# EAGLE design aardvark-v0.70 (EAGLE 9.6.2)
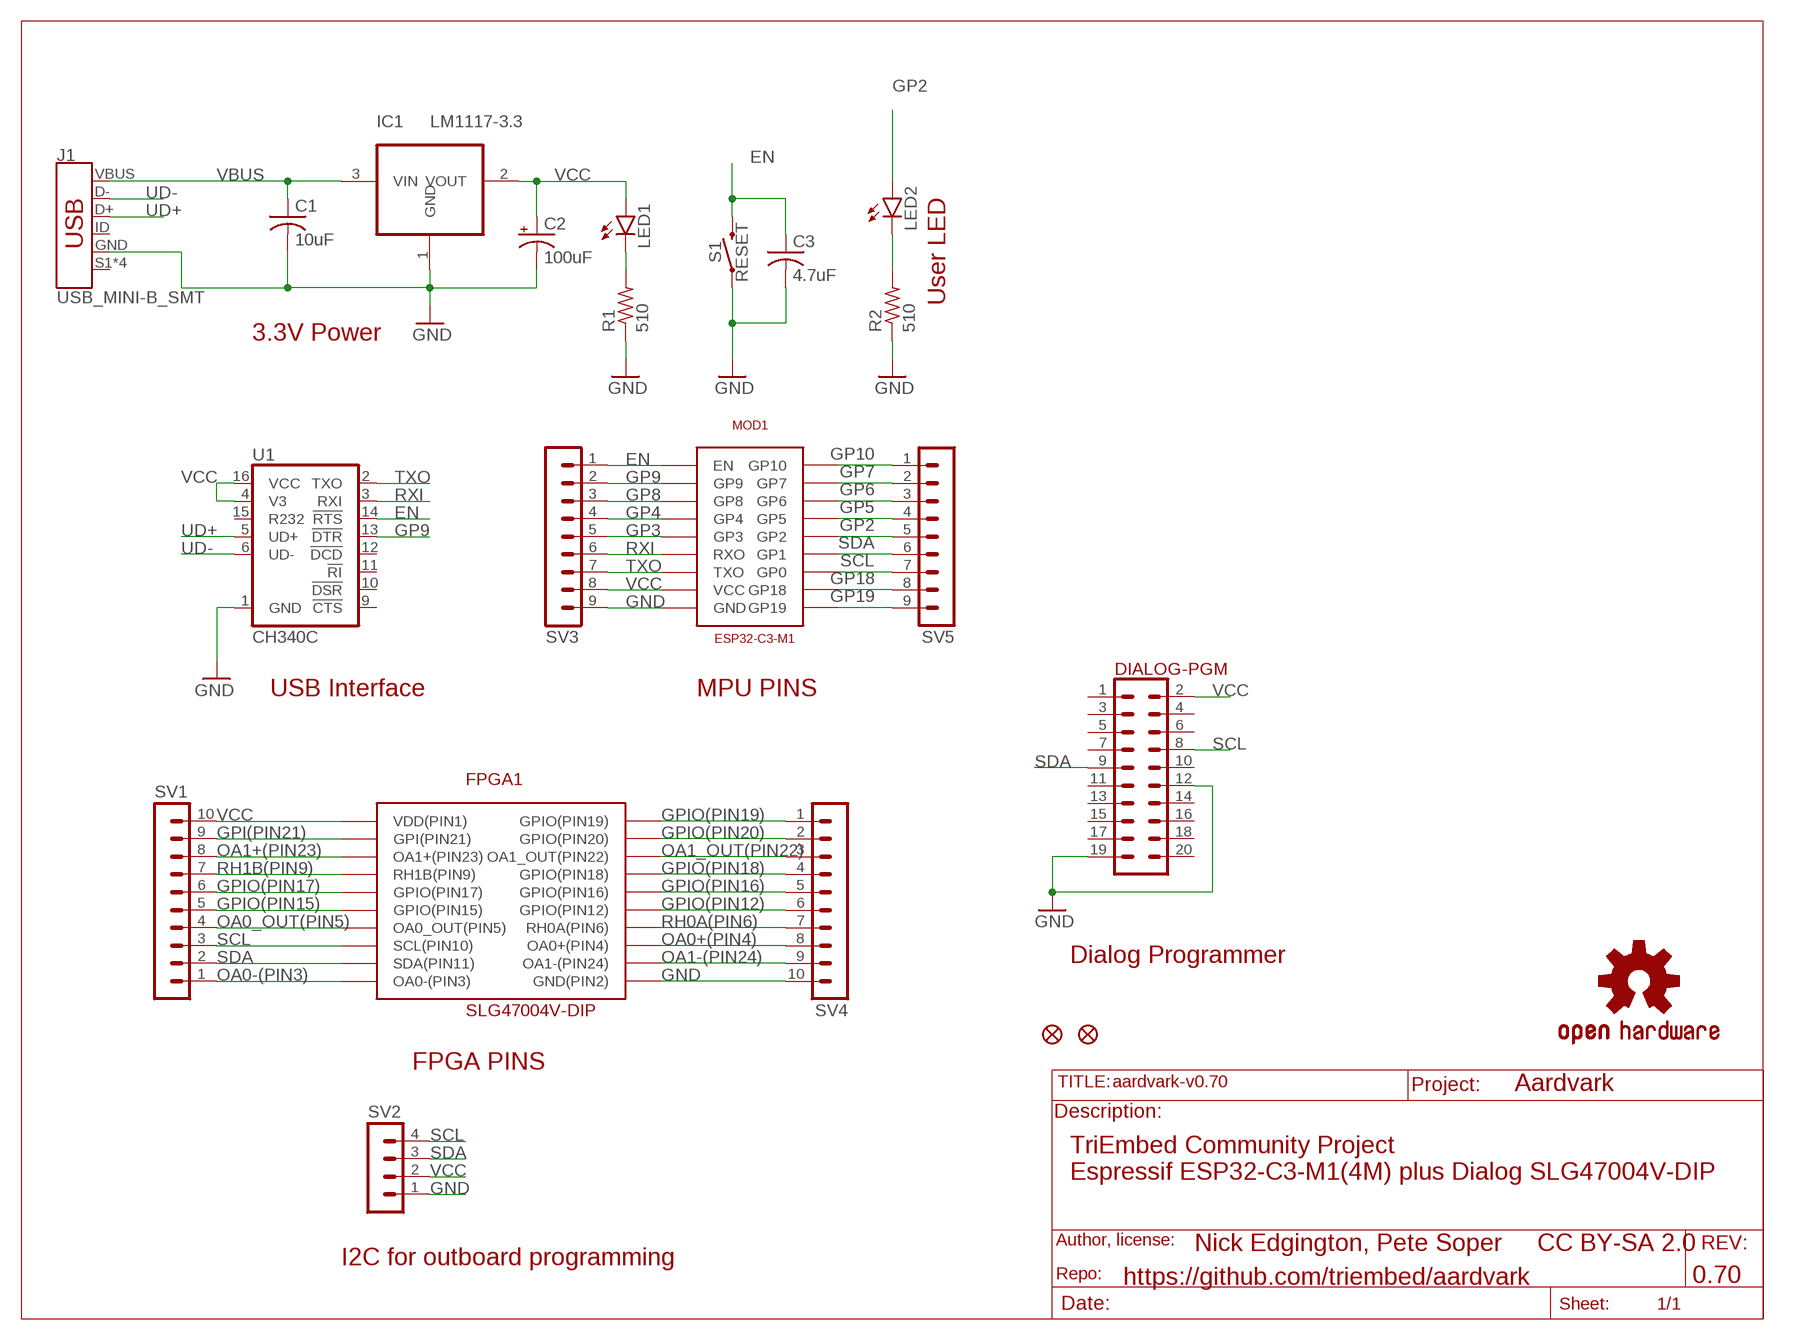
[diagram p0: schematic, sheet 1]

## Parts
C1  10uF  C-USC0805  [C0805]
C2  100uF  47UF-POLAR-PANASONIC_D-50V-20%  [PANASONIC_D]
C3  4.7uF  C-USC0805  [C0805]
DIALOG-PGM  CONN_10X2  [2X10]
FD1  FIDUCIAL1X2  [FIDUCIAL-1X2]
FD2  FIDUCIAL1X2  [FIDUCIAL-1X2]
FPGA1  SLG47004V-DIP  SLG47004V_DIP  [SLG47004V-DIP]
IC1  LM1117-3.3  REG1117  [SOT223]
J1  USB_MINI-B_SMT  [USB-MINIB]
LED1  LEDCHIP-LED0805  [CHIP-LED0805]
LED2  LEDCHIP-LED0805  [CHIP-LED0805]
LOGO1  OSHW-LOGOMINI  [OSHW-LOGO-MINI]
MOD1  ESP32-C3-M1  AITHINKER-C3-M1  [AITHINKER-C3-M1]
R1  510  R-US_R0805  [R0805]
R2  510  R-US_R0805  [R0805]
S1  RESET  MOMENTARY-SWITCH-SPST-SMD-6.0X3.5MM  [TACTILE_SWITCH_SMD_6.0X3.5MM]
SV1  MA10-1  [MA10-1]
SV2  MA04-1  [MA04-1]
SV3  MA09-1  [MA09-1]
SV4  MA10-1  [MA10-1]
SV5  MA09-1  [MA09-1]
U1  CH340C  [SO016]

## Nets
EN: C3.1 MOD1.PIN1(EN) S1.2 SV3.1 U1.14(!RTS)
GND [power]: C1.2 C2.- C3.2 DIALOG-PGM.12 DIALOG-PGM.19 FPGA1.11(GND(PIN2)) IC1.1(GND) J1.GND MOD1.PIN9(GND) R1.1 R2.1 S1.1 SV2.1 SV3.9 SV4.10 U1.1(GND)
GP2: LED2.A MOD1.PIN14(GP2) SV5.5
GP3: MOD1.PIN5(GP3) SV3.5
GP4: MOD1.PIN4(GP4) SV3.4
GP5: MOD1.PIN15(GP5) SV5.4
GP6: MOD1.PIN16(GP6) SV5.3
GP7: MOD1.PIN17(GP7) SV5.2
GP8: MOD1.PIN3(GP8) SV3.3
GP9: MOD1.PIN2(GP9) SV3.2 U1.13(!DTR)
GP10: MOD1.PIN18(GP10) SV5.1
GP18: MOD1.PIN11(GP18) SV5.8
GP19: MOD1.PIN10(GP19) SV5.9
GPI(PIN21): FPGA1.2(GPI(PIN21)) SV1.9
GPIO(PIN12): FPGA1.15(GPIO(PIN12)) SV4.6
GPIO(PIN15): FPGA1.6(GPIO(PIN15)) SV1.5
GPIO(PIN16): FPGA1.16(GPIO(PIN16)) SV4.5
GPIO(PIN17): FPGA1.5(GPIO(PIN17)) SV1.6
GPIO(PIN18): FPGA1.17(GPIO(PIN18)) SV4.4
GPIO(PIN19): FPGA1.20(GPIO(PIN19)) SV4.1
GPIO(PIN20): FPGA1.19(GPIO(PIN20)) SV4.2
N$1: LED2.C R2.2
N$3: LED1.C R1.2
OA0+(PIN4): FPGA1.13(OA0+(PIN4)) SV4.8
OA0-(PIN3): FPGA1.10(OA0-(PIN3)) SV1.1
OA0_OUT(PIN5): FPGA1.7(OA0_OUT(PIN5)) SV1.4
OA1+(PIN23): FPGA1.3(OA1+(PIN23)) SV1.8
OA1-(PIN24): FPGA1.12(OA1-(PIN24)) SV4.9
OA1_OUT(PIN22): FPGA1.18(OA1_OUT(PIN22)) SV4.3
RH0A(PIN6): FPGA1.14(RH0A(PIN6)) SV4.7
RH1B(PIN9): FPGA1.4(RH1B(PIN9)) SV1.7
RXI: MOD1.PIN6(RXO) SV3.6 U1.3(RXI)
SCL: DIALOG-PGM.8 FPGA1.8(SCL(PIN10)) MOD1.PIN12(GP0) SV1.3 SV2.4 SV5.7
SDA: DIALOG-PGM.9 FPGA1.9(SDA(PIN11)) MOD1.PIN13(GP1) SV1.2 SV2.3 SV5.6
TXO: MOD1.PIN7(TXO) SV3.7 U1.2(TXO)
UD+: J1.D+ U1.5(UD+)
UD-: J1.D- U1.6(UD-)
VBUS [power]: C1.1 IC1.3(VIN) J1.VBUS
VCC [power]: C2.+ DIALOG-PGM.2 FPGA1.1(VDD(PIN1)) IC1.2(VOUT) LED1.A MOD1.PIN8(VCC) SV1.10 SV2.2 SV3.8 U1.4(V3) U1.16(VCC)
Unconnected: DIALOG-PGM.1 DIALOG-PGM.3 DIALOG-PGM.4 DIALOG-PGM.5 DIALOG-PGM.6 DIALOG-PGM.7 DIALOG-PGM.10 DIALOG-PGM.11 DIALOG-PGM.13 DIALOG-PGM.14 DIALOG-PGM.15 DIALOG-PGM.16 DIALOG-PGM.17 DIALOG-PGM.18 DIALOG-PGM.20 J1.ID J1.S1(SHIELD) J1.S2(SHIELD) J1.S3(SHIELD) J1.S4(SHIELD) U1.9(!CTS) U1.10(!DSR) U1.11(!RI) U1.12(!DCD) U1.15(R232)

## Notes on the sheet
- User LED
- 3.3V Power
- USB Interface | MPU PINS
- Dialog Programmer
- FPGA PINS
- Aardvark
- TriEmbed Community Project
  Espressif ESP32-C3-M1(4M) plus Dialog SLG47004V-DIP
- Nick Edgington, Pete Soper     CC BY-SA 2.0
- I2C for outboard programming
- https://github.com/triembed/aardvark | 0.70

## Library data of the parts
C1 C3 = rcl:C-US: CAPACITOR, American symbol; SPICEPREFIX: C
C2 = SparkFun-Capacitors:47UF-POLAR: 47µF polarized capacitors A capacitor is a passive two-terminal electrical component used to store electrical energy temporarily in an electric field.
DIALOG-PGM = SparkFun-Connectors:CONN_10X2: Multi connection point. Often used as Generic Header-pin footprint for 0.1 inch spaced/style header connections On any of the 0.1 inch spaced packages, you can populate with these: Break Away Headers - Straight <https://www.sparkfun.com/products/116> (PRT-00116) Break Away Male Headers - Right Angle <https://www.sparkfun.com/products/553> (PRT-00553) Female Headers <https://www.sparkfun.com/products/115> (PRT-00115) Break Away Headers - Machine Pin <https://www.sparkfun.com/products/117> (PRT-00117) Break Away Female Headers - Swiss Machine Pin <https://www.sparkfun.com/products/743> (PRT-00743) Special note about the "SPECIAL" package: This was SPECIALLY designed to be used with our Graphic LCD Backpack. Be sure you want to use this! It is not only staggered on each line of header holes, but IT IS ALSO offset of the center point of the top and bottom lines by 5 mil. This causes the headers to lock into place on the "standard" footprint on the LCD screen. The extra squares on the tdocu layer are there simply to reference other pins (if you were to actually populate a longer header than ten long - this is what we do with the backpacks).
FD1 FD2 = apexprotofactory:FIDUCIAL: Fiducial Alignment Points Derived from SparkFun library but with cream (paste) included in pad. This is necessary for stencil creation by OSH Stencils!!
FPGA1 = SLG47004V-DIP:SLG47004V_DIP
IC1 = burr-brown:REG1117: 800mA and 1A Low Dropout (LDO) Positive Regulator 1.8V, 2.5V, 2.85V, 3.3V, 5V, and Adj; MPN: REG1117; OC_FARNELL: 1097566; OC_NEWARK: 14P6981
J1 = SparkFun-Connectors:USB_MINI-B: USB type Mini-B Connector Breaks out 5th pin, and includes shield pins if needed. SparkFun Products: SparkFun FTDI Basic Breakout <https://www.sparkfun.com/products/9716> SparkFun XBee Explorer USB <https://www.sparkfun.com/products/11812> SparkFun Redboard <https://www.sparkfun.com/products/12757>; PROD_ID: CONN-08193; SF_ID: PRT-00587
LED1 LED2 = led:LED: LED OSRAM: - CHIPLED LG R971, LG N971, LY N971, LG Q971, LY Q971, LO R971, LY R971 LH N974, LH R974 LS Q976, LO Q976, LY Q976 LO Q996 - Hyper CHIPLED LW Q18S LB Q993, LB Q99A, LB R99A - SideLED LS A670, LO A670, LY A670, LG A670, LP A670 LB A673, LV A673, LT A673, LW A673 LH A674 LY A675 LS A676, LA A676, LO A676, LY A676, LW A676 LS A679, LY A679, LG A679 - Hyper Micro SIDELED® LS Y876, LA Y876, LO Y876, LY Y876 LT Y87S - SmartLED LW L88C, LW L88S LB L89C, LB L89S, LG L890 LS L89K, LO L89K, LY L89K LS L896, LA L896, LO L896, LY L896 - TOPLED LS T670, LO T670, LY T670, LG T670, LP T670 LSG T670, LSP T670, LSY T670, LOP T670, LYG T670 LG T671, LOG T671, LSG T671 LB T673, LV T673, LT T673, LW T673 LH T674 LS T676, LA T676, LO T676, LY T676, LB T676, LH T676, LSB T676, LW T676 LB T67C, LV T67C, LT T67C, LS T67K, LO T67K, LY T67K, LW E67C LS E67B, LA E67B, LO E67B, LY E67B, LB E67C, LV E67C, LT E67C LW T67C LS T679, LY T679, LG T679 LS T770, LO T770, LY T770, LG T770, LP T770 LB T773, LV T773, LT T773, LW T773 LH T774 LS E675, LA E675, LY E675, LS T675 LS T776, LA T776, LO T776, LY T776, LB T776 LHGB T686 LT T68C, LB T68C - Hyper Mini TOPLED® LB M676 - Mini TOPLED Santana® LG M470 LS M47K, LO M47K, LY M47K Source: http://www.osram.convergy.de LUXEON: - LUMILED® LXK2-PW12-R00, LXK2-PW12-S00, LXK2-PW14-U00, LXK2-PW14-V00 LXK2-PM12-R00, LXK2-PM12-S00, LXK2-PM14-U00 LXK2-PE12-Q00, LXK2-PE12-R00, LXK2-PE12-S00, LXK2-PE14-T00, LXK2-PE14-U00 LXK2-PB12-K00, LXK2-PB12-L00, LXK2-PB12-M00, LXK2-PB14-N00, LXK2-PB14-P00, LXK2-PB14-Q00 LXK2-PR12-L00, LXK2-PR12-M00, LXK2-PR14-Q00, LXK2-PR14-R00 LXK2-PD12-Q00, LXK2-PD12-R00, LXK2-PD12-S00 LXK2-PH12-R00, LXK2-PH12-S00 LXK2-PL12-P00, LXK2-PL12-Q00, LXK2-PL12-R00 Source: www.luxeon.com KINGBRIGHT: KA-3528ASYC Source: www.kingbright.com
LOGO1 = SparkFun-Aesthetics:OSHW-LOGO: Open-Source Hardware (OSHW) Logo This logo indicates the piece of hardware it is found on incorporates a OSHW license and/or adheres to the definition of open source hardware found here: http://freedomdefined.org/OSHW
MOD1 = aithinker-C3-M1:AITHINKER-C3-M1: ESPRESSIF ESP32 C3 M1 module from AI Thinker
R1 R2 = rcl:R-US_: RESISTOR, American symbol; SPICEPREFIX: R
S1 = SparkFun-Switches:MOMENTARY-SWITCH-SPST: Momentary Switch (Pushbutton) - SPST Normally-open (NO) SPST momentary switches (buttons, pushbuttons). Variants PTH-12MM - 12mm square, through-hole Momentary Pushbutton Switch - 12mm Square <https://www.sparkfun.com/products/9190> (COM-09190) PTH-6.0MM, PTH-6.0MM-KIT - 6.0mm square, through-hole Mini Pushbutton Switch <https://www.sparkfun.com/products/97> (COM-00097) KIT package intended for soldering kit's - only one side of pads' copper is exposed. PTH-RIGHT-ANGLE-KIT - Right-angle, through-hole Right Angle Tactile Button <https://www.sparkfun.com/products/10791> - Used on SparkFun BigTime Watch Kit <https://www.sparkfun.com/products/11734> SMD-12MM - 12mm square, surface-mount Tactile Button - SMD (12mm) <https://www.sparkfun.com/products/12993> (COM-12993) Used on SparkFun PicoBoard <https://www.sparkfun.com/products/11888> SMD-4.5MM - 4.5mm Square Trackball Switch Used on SparkFun Blackberry Trackballer Breakout <https://www.sparkfun.com/products/13169> SMD-4.6MMX2.8MM - 4.60mm x 2.80mm, surface mount Used on SparkFun SAMD21 Mini Breakout <https://www.sparkfun.com/products/13664> SMD-5.2MM, SMD-5.2-REDUNDANT - 5.2mm square, surface-mount Mini Pushbutton Switch - SMD <https://www.sparkfun.com/products/8720> (COM-08720) Used on Arduino Pro Mini <https://www.sparkfun.com/products/11114> REDUNDANT package connects both switch circuits together SMD-6.0X3.5MM - 6.0 x 3.5mm, surface mount Momentary Reset Switch SMD <https://www.sparkfun.com/products/8229> (COM-08229) SMD-6.2MM-TALL - 6.2mm square, surface mount Tactile Button - SMD (6mm) <https://www.sparkfun.com/products/12992> Used on SparkFun Digital Sandbox <https://www.sparkfun.com/products/12651> SMD-RIGHT-ANGLE - Right-angle, surface mount Used on SparkFun Block for Intel® Edison - Arduino <https://www.sparkfun.com/products/13036>; PROD_ID: SWCH-14278; SF_SKU: COM-08229
SV1 SV4 = con-lstb:MA10-1: PIN HEADER; OC_FARNELL: unknown; OC_NEWARK: unknown
SV2 = con-lstb:MA04-1: PIN HEADER; OC_FARNELL: unknown; OC_NEWARK: unknown
SV3 SV5 = con-lstb:MA09-1: PIN HEADER; OC_FARNELL: unknown; OC_NEWARK: unknown
U1 = SparkFun-IC-Comms:CH340C; PROD_ID: IC-14038

## Net classes
1 power: width 0.381 mm

## Board
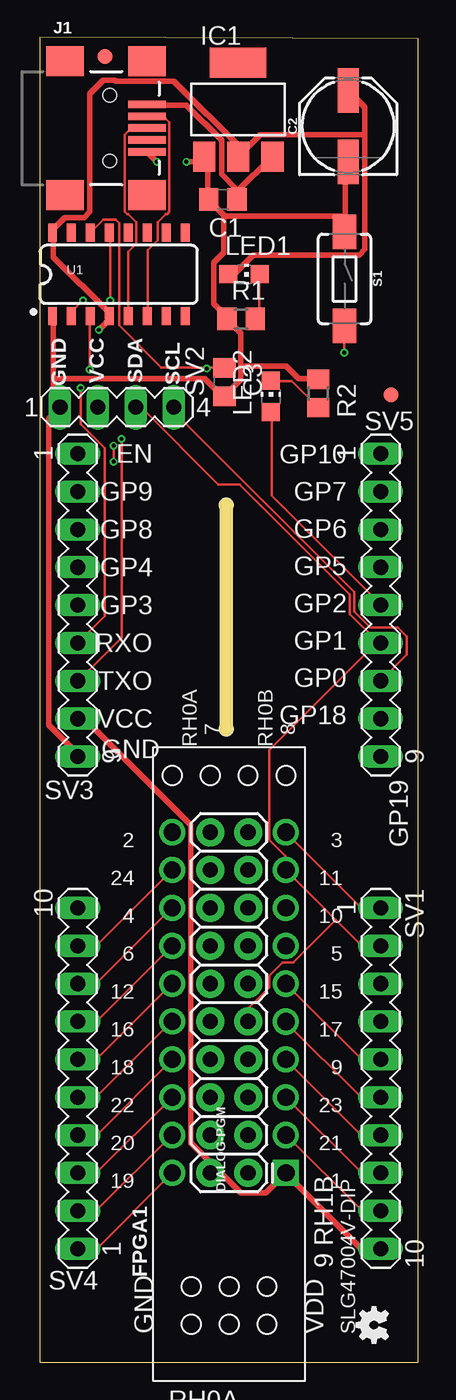
[diagram p1: board, top side]
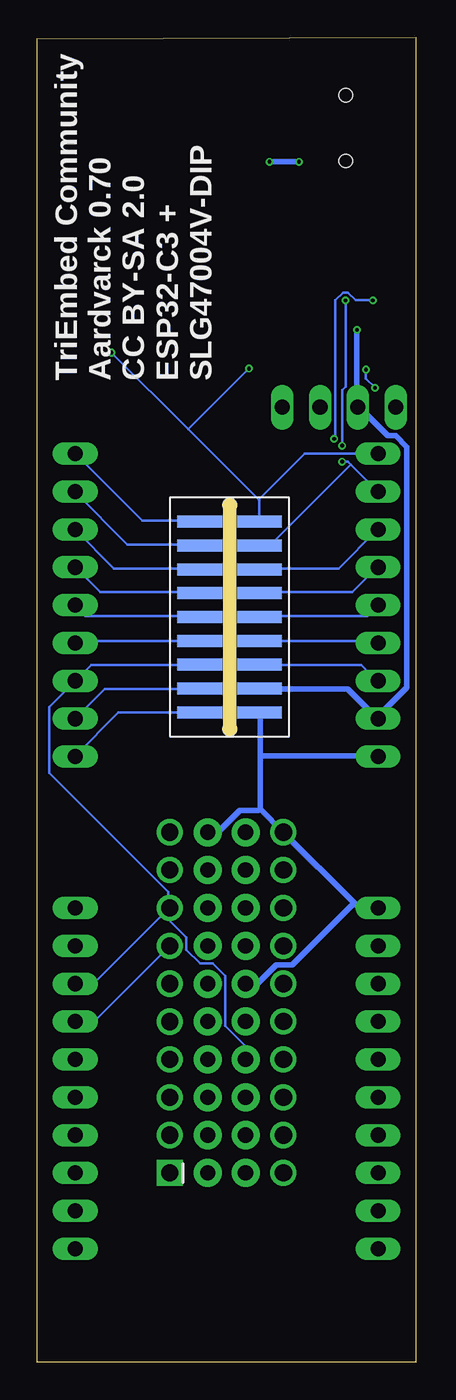
[diagram p2: board, bottom side, seen from below]

Size 25.4 x 88.9 mm. Coordinates in mm from the lower left corner, seen from the top.
Outline: 0,0 25.4,0 25.4,88.8 0,88.9 0,0
Copper layers (1*16): Top 0.035559375mm / dielectric 1.6mm / Bottom 0.035559375mm
Design rules "oshpark-2layer": minimum track width 6mil, minimum drill 10mil, track to track 6mil, track to pad 6mil, pad to pad 6mil, via to via 6mil, smd to smd 6mil, copper to edge 15mil, drill to drill 6mil, minimum pad ring 5mil, minimum via ring 5mil, stop-mask expansion 2.5mil, vias tented up to drill 0mil, thermal gap 10mil

### Footprints (pad centres in the part's own frame; a part is rotated, then mirrored left to right if it is on the bottom)
C0805 = smd 1.3 x 1.5: 1 -0.95,0; 2 0.95,0
PANASONIC_D = smd 3 x 1.4: + 2.4,0; - -2.4,0
2X10 = drill 1.016 pad 1.88: 1 0,0; 2 0,2.54; 3 2.54,0; 4 2.54,2.54; 5 5.08,0; 6 5.08,2.54; 7 7.62,0; 8 7.62,2.54; 9 10.16,0; 10 10.16,2.54; 11 12.7,0; 12 12.7,2.54; 13 15.24,0; 14 15.24,2.54; 15 17.78,0; 16 17.78,2.54; 17 20.32,0; 18 20.32,2.54; 19 22.86,0; 20 22.86,2.54
FIDUCIAL-1X2 = smd 1 x 1: 1 0,0
SLG47004V-DIP = drill 1.15 pad 1.75 square: 1 -5.08,-3.81 | drill 1.15 pad 1.75: 2 -2.54,-3.81; 3 0,-3.81; 4 2.54,-3.81; 5 5.074,-3.81; 6 7.62,-3.81; 7 10.16,-3.81; 8 12.7,-3.81; 9 15.24,-3.81; 10 17.78,-3.81; 11 17.78,3.81; 12 15.24,3.81; 13 12.7,3.81; 14 10.16,3.81; 15 7.62,3.81; 16 5.08,3.81; 17 2.54,3.81; 18 0,3.81; 19 -2.54,3.81; 20 -5.08,3.81
SOT223 = smd 1.499 x 2.007: 1 -2.261,-3.15; 2 0.025,-3.15; 3 2.311,-3.15 | smd 3.81 x 2.007: 4 0,3.15
USB-MINIB = smd 2.5 x 0.5: D+ 2.5,0; D- 2.5,0.8; GND 2.5,-1.6; ID 2.5,-0.8; VBUS 2.5,1.6 | smd 2.5 x 2: S1 -3,4.5; S2 2.5,4.5; S3 -3,-4.5; S4 2.5,-4.5 | hole 0.9: 0,2.2; 0,-2.2
CHIP-LED0805 = smd 1.2 x 1.2: A 0,-1.05; C 0,1.05
AITHINKER-C3-M1 = smd 0.8 x 3 bottom: PIN1 -6.4,-2; PIN2 -4.8,-2; PIN3 -3.2,-2; PIN4 -1.6,-2; PIN5 0,-2; PIN6 1.6,-2; PIN7 3.2,-2; PIN8 4.8,-2; PIN9 6.4,-2; PIN10 6.4,2; PIN11 4.8,2; PIN12 3.2,2; PIN13 1.6,2; PIN14 0,2; PIN15 -1.6,2; PIN16 -3.2,2; PIN17 -4.8,2; PIN18 -6.4,2 | hole 0.9: -7.5,0; 7.5,0
R0805 = smd 1.3 x 1.5: 1 -0.95,0; 2 0.95,0
TACTILE_SWITCH_SMD_6.0X3.5MM = smd 2.3 x 1.6: 1 -3.15,0; 2 3.15,0
MA10-1 = drill 1.016 long: 1 -11.43,0; 2 -8.89,0; 3 -6.35,0; 4 -3.81,0; 5 -1.27,0; 6 1.27,0; 7 3.81,0; 8 6.35,0; 9 8.89,0; 10 11.43,0
MA04-1 = drill 1.016 long: 1 -3.81,0; 2 -1.27,0; 3 1.27,0; 4 3.81,0
MA09-1 = drill 1.016 long: 1 -10.16,0; 2 -7.62,0; 3 -5.08,0; 4 -2.54,0; 5 0,0; 6 2.54,0; 7 5.08,0; 8 7.62,0; 9 10.16,0
SO016 = smd 0.6 x 1.2: 1 -4.445,-2.8; 2 -3.175,-2.8; 3 -1.905,-2.8; 4 -0.635,-2.8; 5 0.635,-2.8; 6 1.905,-2.8; 7 3.175,-2.8; 8 4.445,-2.8; 9 4.445,2.8; 10 3.175,2.8; 11 1.905,2.8; 12 0.635,2.8; 13 -0.635,2.8; 14 -1.905,2.8; 15 -3.175,2.8; 16 -4.445,2.8

### Placement (x,y rotation side)
C1  12.29,78.02 180 top
C2  20.69,82.93 90 top
C3  12.38,65.76 270 top
DIALOG-PGM  13.97,12.7 90 top
FD1  4.38,87.6 0 top
FD2  23.56,64.9 0 top
FPGA1  12.7,17.78 90 top
IC1  13.29,84.05 0 top
J1  4.7,82.8 0 top
LED1  13.7,73 270 top
LED2  15.5,64.8 0 top
LOGO1  22.4,2.5 90 top
MOD1  12.5,50 270 top
R1  13.5,70 0 top
R2  18.68,65 270 top
S1  20.44,72.68 270 top
SV1  22.86,19.05 270 top
SV2  5.17,64.07 0 top
SV3  2.54,50.8 270 top
SV4  2.54,19.05 90 top
SV5  22.86,50.8 270 top
U1  5.3,73 0 top

### Tracks (layer width: path | path; a pad name or v marks a point on that pad's centre or on a via)
EN  (via drill 0.25)
  Top 0.152: 11.2,66.75 12.34,66.75 C3.1 | 11.2,66.75 8.15,66.75 5.33,69.57 5.33,76.43 5.11,76.66 4.27,76.66 3.43,75.82 U1.14 | v20.42,67.74 20.42,69.49 S1.2 | v11.2,66.67 11.2,66.75
  Bottom 0.152: 10.55,57.87 10.52,57.84 10.52,56.46 MOD1.PIN1 | 10.55,57.87 15.28,62.6 | 15.28,62.6 v20.42,67.74 | SV3.1 7.47,60.96 10.55,57.87 | 15.28,62.6 v11.2,66.67
GND  (via drill 0.25)
  Top 0.381: C2.- 20.65,80.47 20.5,80.31 20.5,75.89 S1.1 20.34,76.89 12.42,76.89 | v7.85,80.54 7.24,81.15 J1.GND | v9.83,80.54 10.67,80.54 10.9,80.77 IC1.1 11.05,80.85 11.28,80.62 11.28,78.03 C1.2 11.43,77.88 12.42,76.89 | 0.91,65.99 0.91,64.47 1.29,64.08 SV2.1 1.22,63.93 0.61,63.32 0.61,42.75 2.52,40.84 2.52,40.69 SV3.9 | 0.91,65.99 0.91,70.18 U1.1 | 13.49,66.83 13.49,69.04 12.57,69.95 R1.1 12.5,70.18 11.66,71.02 11.66,73.76 12.34,74.45 12.34,76.73 12.42,76.89 | 13.49,66.83 13.49,65.91 12.42,64.85 C3.2 12.19,64.85 11.05,65.99 0.91,65.99 | 13.49,66.83 16.54,66.83 17.37,65.99 18.67,65.99 R2.1
  Bottom 0.381: 10.44,37.11 10.44,40.69 | 10.44,40.69 10.44,43.59 MOD1.PIN9 | 10.44,37.11 FPGA1.11 4.15,30.82 | SV4.10 3.81,30.48 4.15,30.82 | 10.44,40.69 2.59,40.69 SV3.9 | 4.15,30.82 8.31,26.67 9.37,26.67 10.59,25.45 11.43,25.45 DIALOG-PGM.12 | DIALOG-PGM.19 13.95,35.59 13.26,35.59 11.81,37.03 10.59,37.03 10.44,37.11 | v9.83,80.54 v7.85,80.54
GP2
  Top 0.152: LED2.A 15.54,63.7 15.54,58.14 22.86,50.83 SV5.5
  Bottom 0.152: MOD1.PIN14 14.55,50.06 22.17,50.06 22.86,50.75 SV5.5
GP3
  Bottom 0.152: SV3.5 3.28,50.06 10.44,50.06 MOD1.PIN5
GP4
  Bottom 0.152: MOD1.PIN4 10.44,51.66 4.27,51.66 2.59,53.34 SV3.4
GP5
  Bottom 0.152: SV5.4 21.18,51.66 14.55,51.66 MOD1.PIN15
GP6
  Bottom 0.152: MOD1.PIN16 14.55,53.26 20.27,53.26 22.86,55.85 SV5.3
GP7
  Bottom 0.152: MOD1.PIN17 14.55,54.86 19.36,54.86 22.86,58.37 SV5.2
GP8
  Bottom 0.152: MOD1.PIN3 10.44,53.26 5.18,53.26 2.59,55.85 SV3.3
GP9  (via drill 0.25)
  Top 0.152: v4.72,71.25 4.72,75.74 U1.13 | v4.95,60.43 v4.95,61.49
  Bottom 0.152: v4.72,71.25 4.72,65.46 4.95,65.23 v4.95,61.49 | v4.95,60.43 4.57,60.43 4.38,60.24 | 4.38,60.24 2.59,58.45 SV3.2 | 4.38,60.24 9.75,54.86 10.44,54.86 MOD1.PIN2
GP10
  Bottom 0.152: SV5.1 18.36,56.46 14.55,56.46 MOD1.PIN18
GP18
  Bottom 0.152: MOD1.PIN11 14.55,45.19 20.88,45.19 22.86,43.2 SV5.8
GP19
  Bottom 0.152: MOD1.PIN10 14.55,43.59 19.96,43.59 22.86,40.69 SV5.9
GPI(PIN21)
  Top 0.152: SV1.9 22.86,10.21 21.57,10.21 16.54,15.24 FPGA1.2
GPIO(PIN12)
  Top 0.152: SV4.6 2.59,20.34 3.81,20.34 8.84,25.38 FPGA1.15
GPIO(PIN15)
  Top 0.152: FPGA1.6 21.57,20.34 22.86,20.34 SV1.5
GPIO(PIN16)
  Top 0.152: SV4.5 2.59,17.83 3.81,17.83 8.84,22.86 FPGA1.16
GPIO(PIN17)
  Top 0.152: SV1.6 22.86,17.83 21.49,17.83 16.54,22.78 FPGA1.5
GPIO(PIN18)
  Top 0.152: SV4.4 3.81,15.24 FPGA1.17
GPIO(PIN19)
  Top 0.152: SV4.1 3.81,7.62 FPGA1.20
GPIO(PIN20)
  Top 0.152: SV4.2 2.59,10.21 3.81,10.21 8.84,15.24 FPGA1.19
N$1
  Top 0.152: LED2.C 15.54,65.84 16.92,65.84 18.67,64.08 R2.2
N$3
  Top 0.152: LED1.C 14.71,73 14.71,70.26 14.48,70.03 R1.2
OA0+(PIN4)
  Top 0.152: SV4.8 2.59,25.45 3.81,25.45 8.84,30.48 FPGA1.13
OA0-(PIN3)
  Top 0.152: SV1.1 21.57,30.48 16.54,35.51 FPGA1.10
OA0_OUT(PIN5)
  Bottom 0.152: SV1.4 21.57,22.86 16.54,27.89 FPGA1.7
OA1+(PIN23)
  Top 0.152: FPGA1.3 21.57,12.72 22.86,12.72 SV1.8
OA1-(PIN24)
  Top 0.152: SV4.9 2.59,27.96 3.81,27.96 8.84,32.99 FPGA1.12
OA1_OUT(PIN22)
  Top 0.152: SV4.3 2.59,12.72 3.81,12.72 8.84,17.75 FPGA1.18
RH0A(PIN6)
  Top 0.152: SV4.7 3.81,22.86 FPGA1.14
RH1B(PIN9)
  Top 0.152: SV1.7 21.57,15.24 16.54,20.27 FPGA1.4
RXI  (via drill 0.25)
  Top 0.152: v3.35,66.6 3.35,70.18 U1.3 | v2.74,65.38 2.74,62.94 4.34,61.34 4.34,50.06 SV3.6
  Bottom 0.152: v3.35,66.6 3.35,65.99 v2.74,65.38 | SV3.6 2.67,48.39 10.44,48.39 MOD1.PIN6
SCL
  Top 0.152: SV5.7 24.61,47.47 24.61,48.69 24,49.3 22.17,49.3 21.11,50.37 21.11,51.66 8.99,63.78 8.99,64.01 SV2.4
  Bottom 0.152: SV1.3 22.86,25.45 21.57,25.45 16.54,30.48 FPGA1.8 | DIALOG-PGM.8 11.43,21.18 12.8,22.55 12.8,25.91 13.64,26.75 14.48,26.75 15.39,27.66 15.39,28.5 16.92,30.02 FPGA1.8 | MOD1.PIN12 14.55,46.79 21.79,46.79 SV5.7 24.61,43.97 24.61,39.55 16.61,31.55 16.61,30.48 FPGA1.8
SDA
  Top 0.152: 19.85,29.68 FPGA1.9 16.46,33.07 16.46,33.98 15.39,35.05 15.39,41.07 22.63,48.31 SV5.6 22.86,48.31 22.71,48.31 20.8,50.22 20.8,51.51 13.41,58.9 11.96,58.9 6.86,64.01 6.48,64.01 SV2.3 | 19.85,29.68 21.57,27.96 22.86,27.96 SV1.2 | 19.85,29.68 16.99,26.82 16.31,26.82 15.39,25.91 15.39,25.15 14.02,23.77 14.02,22.86 DIALOG-PGM.9
  Bottom 0.152: MOD1.PIN13 14.55,48.39 22.78,48.39 22.86,48.31 SV5.6
TXO  (via drill 0.25)
  Top 0.152: v2.9,71.25 2.13,70.48 2.13,70.26 U1.2 | v5.49,61.95 5.49,48.62 2.59,45.72 SV3.7
  Bottom 0.152: v2.9,71.25 4.04,71.25 4.57,71.78 4.88,71.78 5.41,71.25 5.41,62.03 v5.49,61.95 | MOD1.PIN7 10.44,46.79 3.66,46.79 2.59,45.72 SV3.7
UD+
  Top 0.152: U1.5 5.94,70.26 5.94,74.52 6.48,75.06 6.48,76.5 5.94,77.04 5.87,77.04 5.71,77.19 5.71,82.37 6.1,82.75 7.16,82.75 J1.D+
UD-
  Top 0.152: U1.6 7.24,70.26 7.24,74.6 7.92,75.29 7.92,76.5 8.46,77.04 8.53,77.04 8.69,77.19 8.69,83.21 8.31,83.59 7.24,83.59 J1.D-
VBUS
  Top 0.381: IC1.3 15.54,80.85 13.26,78.56 13.26,78.03 C1.1 13.18,78.72 12.19,79.7 12.19,81.99 9.83,84.35 7.24,84.35 J1.VBUS
VCC  (via drill 0.25)
  Top 0.381: SV1.10 21.57,7.62 16.54,12.65 FPGA1.1 15.16,11.35 13.49,11.35 12.19,12.65 11.43,12.65 DIALOG-PGM.2 11.35,12.88 11.35,13.49 10.13,14.71 10.13,36.04 3.05,43.13 2.59,43.13 SV3.8 | 21.79,82.37 21.79,84.2 20.73,85.27 C2.+ | 21.79,82.37 21.79,74.68 21.41,74.3 14.33,74.3 13.11,73.08 12.72,73.08 LED1.A | 21.79,82.37 14.78,82.37 13.34,80.92 IC1.2 13.56,81.38 8.99,85.95 5.11,85.95 5.03,86.03 4.27,86.03 3.35,85.11 3.35,77.19 2.97,76.81 1.68,76.81 0.84,75.97 U1.16 0.91,75.74 0.91,74.14 4.65,70.41 4.65,70.26 U1.4 4.72,70.03 v3.96,69.27
  Bottom 0.381: MOD1.PIN8 10.44,45.19 4.57,45.19 2.59,43.2 SV3.8 2.52,43.36 0.61,45.26 0.61,61.42 1.37,62.18 1.91,62.18 3.73,64.01 SV2.2 3.96,64.08 v3.96,69.27

### Text on the board
tNames: GND | VCC | SDA | SCL | EN | GP10 | GP9 | GP7 | GP8 | GP6 | GP4 | GP5 | GP3 | GP2 | RXO | GP1 | TXO | GP0 | VCC | GP18 | GND | GP19
bNames: TriEmbed Community / Aardvarck 0.70 / CC BY-SA 2.0 / ESP32-C3 + / SLG47004V-DIP